# Altium project rtm-lamp.PrjPcb (part 6 of 6)
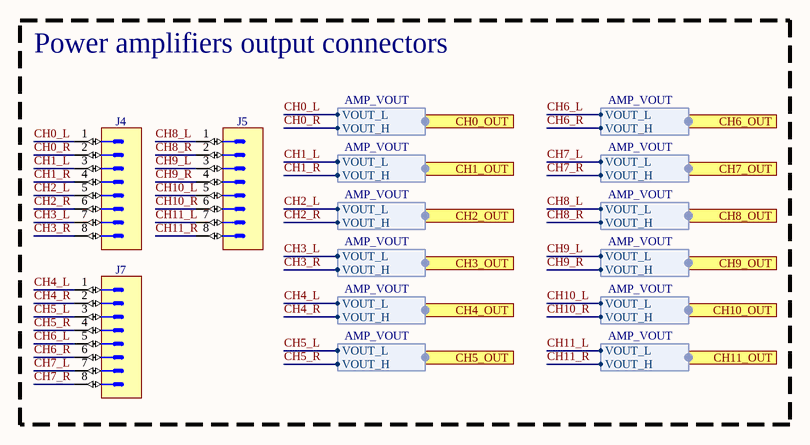
[diagram p9: output-connectors.SchDoc]

## Assembly variants
EXT PWR AFC3.1 SDR: not fitted +2V5 +3V3 +5V +7V +VS1 +VS2 -7V ADC_OCTO_+2V5 ADC_OCTO_+5V ADC_QUAD_+2V5 ADC_QUAD_+5V CNV_ADC1 DAC_VREF+_CH0 DAC_VREF+_CH1 DAC_VREF+_CH2 DAC_VREF+_CH3 DAC_VREF+_CH4 DAC_VREF+_CH5 DAC_VREF+_CH6 DAC_VREF+_CH7 DAC_VREF+_CH8 DAC_VREF+_CH9 DAC_VREF+_CH10 DAC_VREF+_CH11 DACREF1 DACREF2 F2 FTG1 FTG2 FTG3 FTG4 FTG5 FTG6 GND IM_L_CH0 IM_L_CH1 IM_L_CH2 IM_L_CH3 IM_L_CH4 IM_L_CH5 IM_L_CH6 IM_L_CH7 IM_L_CH8 IM_L_CH9 IM_L_CH10 IM_L_CH11 IM_R_CH0 IM_R_CH1 IM_R_CH2 IM_R_CH3 IM_R_CH4 IM_R_CH5 IM_R_CH6 IM_R_CH7 IM_R_CH8 IM_R_CH9 IM_R_CH10 IM_R_CH11 IN+_L_CH0 IN+_L_CH1 IN+_L_CH2 IN+_L_CH3 IN+_L_CH4 IN+_L_CH5 IN+_L_CH6 IN+_L_CH7 IN+_L_CH8 IN+_L_CH9 IN+_L_CH10 IN+_L_CH11 IN+_R_CH0 IN+_R_CH1 IN+_R_CH2 IN+_R_CH3 IN+_R_CH4 IN+_R_CH5 IN+_R_CH6 IN+_R_CH7 IN+_R_CH8 IN+_R_CH9 IN+_R_CH10 IN+_R_CH11 L27 OSC1 R136 R137 R140 REF_ADC_OCTO REF_ADC_QUAD VOUT_L_CH0 VOUT_L_CH1 VOUT_L_CH2 VOUT_L_CH3 VOUT_L_CH4 VOUT_L_CH5 VOUT_L_CH6 VOUT_L_CH7 VOUT_L_CH8 VOUT_L_CH9 VOUT_L_CH10 VOUT_L_CH11 VOUT_R_CH0 VOUT_R_CH1 VOUT_R_CH2 VOUT_R_CH3 VOUT_R_CH4 VOUT_R_CH5 VOUT_R_CH6 VOUT_R_CH7 VOUT_R_CH8 VOUT_R_CH9 VOUT_R_CH10 VOUT_R_CH11
INT PWR AFC3.1 SDR: not fitted +2V5 +3V3 +5V +7V +VS1 +VS2 -7V ADC_OCTO_+2V5 ADC_OCTO_+5V ADC_QUAD_+2V5 ADC_QUAD_+5V CNV_ADC1 DAC_VREF+_CH0 DAC_VREF+_CH1 DAC_VREF+_CH2 DAC_VREF+_CH3 DAC_VREF+_CH4 DAC_VREF+_CH5 DAC_VREF+_CH6 DAC_VREF+_CH7 DAC_VREF+_CH8 DAC_VREF+_CH9 DAC_VREF+_CH10 DAC_VREF+_CH11 DACREF1 DACREF2 F3 FTG1 FTG2 FTG3 FTG4 FTG5 FTG6 GND IM_L_CH0 IM_L_CH1 IM_L_CH2 IM_L_CH3 IM_L_CH4 IM_L_CH5 IM_L_CH6 IM_L_CH7 IM_L_CH8 IM_L_CH9 IM_L_CH10 IM_L_CH11 IM_R_CH0 IM_R_CH1 IM_R_CH2 IM_R_CH3 IM_R_CH4 IM_R_CH5 IM_R_CH6 IM_R_CH7 IM_R_CH8 IM_R_CH9 IM_R_CH10 IM_R_CH11 IN+_L_CH0 IN+_L_CH1 IN+_L_CH2 IN+_L_CH3 IN+_L_CH4 IN+_L_CH5 IN+_L_CH6 IN+_L_CH7 IN+_L_CH8 IN+_L_CH9 IN+_L_CH10 IN+_L_CH11 IN+_R_CH0 IN+_R_CH1 IN+_R_CH2 IN+_R_CH3 IN+_R_CH4 IN+_R_CH5 IN+_R_CH6 IN+_R_CH7 IN+_R_CH8 IN+_R_CH9 IN+_R_CH10 IN+_R_CH11 L27 OSC1 R136 R137 R140 REF_ADC_OCTO REF_ADC_QUAD VOUT_L_CH0 VOUT_L_CH1 VOUT_L_CH2 VOUT_L_CH3 VOUT_L_CH4 VOUT_L_CH5 VOUT_L_CH6 VOUT_L_CH7 VOUT_L_CH8 VOUT_L_CH9 VOUT_L_CH10 VOUT_L_CH11 VOUT_R_CH0 VOUT_R_CH1 VOUT_R_CH2 VOUT_R_CH3 VOUT_R_CH4 VOUT_R_CH5 VOUT_R_CH6 VOUT_R_CH7 VOUT_R_CH8 VOUT_R_CH9 VOUT_R_CH10 VOUT_R_CH11
EXT PWR AFC4 SDR: not fitted +2V5 +3V3 +5V +7V +VS1 +VS2 -7V ADC_OCTO_+2V5 ADC_OCTO_+5V ADC_QUAD_+2V5 ADC_QUAD_+5V CNV_ADC1 DAC_VREF+_CH0 DAC_VREF+_CH1 DAC_VREF+_CH2 DAC_VREF+_CH3 DAC_VREF+_CH4 DAC_VREF+_CH5 DAC_VREF+_CH6 DAC_VREF+_CH7 DAC_VREF+_CH8 DAC_VREF+_CH9 DAC_VREF+_CH10 DAC_VREF+_CH11 DACREF1 DACREF2 F2 FTG1 FTG2 FTG3 FTG4 FTG5 FTG6 GND IM_L_CH0 IM_L_CH1 IM_L_CH2 IM_L_CH3 IM_L_CH4 IM_L_CH5 IM_L_CH6 IM_L_CH7 IM_L_CH8 IM_L_CH9 IM_L_CH10 IM_L_CH11 IM_R_CH0 IM_R_CH1 IM_R_CH2 IM_R_CH3 IM_R_CH4 IM_R_CH5 IM_R_CH6 IM_R_CH7 IM_R_CH8 IM_R_CH9 IM_R_CH10 IM_R_CH11 IN+_L_CH0 IN+_L_CH1 IN+_L_CH2 IN+_L_CH3 IN+_L_CH4 IN+_L_CH5 IN+_L_CH6 IN+_L_CH7 IN+_L_CH8 IN+_L_CH9 IN+_L_CH10 IN+_L_CH11 IN+_R_CH0 IN+_R_CH1 IN+_R_CH2 IN+_R_CH3 IN+_R_CH4 IN+_R_CH5 IN+_R_CH6 IN+_R_CH7 IN+_R_CH8 IN+_R_CH9 IN+_R_CH10 IN+_R_CH11 L28 OSC1 R14 R136 R137 REF_ADC_OCTO REF_ADC_QUAD VOUT_L_CH0 VOUT_L_CH1 VOUT_L_CH2 VOUT_L_CH3 VOUT_L_CH4 VOUT_L_CH5 VOUT_L_CH6 VOUT_L_CH7 VOUT_L_CH8 VOUT_L_CH9 VOUT_L_CH10 VOUT_L_CH11 VOUT_R_CH0 VOUT_R_CH1 VOUT_R_CH2 VOUT_R_CH3 VOUT_R_CH4 VOUT_R_CH5 VOUT_R_CH6 VOUT_R_CH7 VOUT_R_CH8 VOUT_R_CH9 VOUT_R_CH10 VOUT_R_CH11
INT PWR AFC4 SDR: not fitted +2V5 +3V3 +5V +7V +VS1 +VS2 -7V ADC_OCTO_+2V5 ADC_OCTO_+5V ADC_QUAD_+2V5 ADC_QUAD_+5V CNV_ADC1 DAC_VREF+_CH0 DAC_VREF+_CH1 DAC_VREF+_CH2 DAC_VREF+_CH3 DAC_VREF+_CH4 DAC_VREF+_CH5 DAC_VREF+_CH6 DAC_VREF+_CH7 DAC_VREF+_CH8 DAC_VREF+_CH9 DAC_VREF+_CH10 DAC_VREF+_CH11 DACREF1 DACREF2 F3 FTG1 FTG2 FTG3 FTG4 FTG5 FTG6 GND IM_L_CH0 IM_L_CH1 IM_L_CH2 IM_L_CH3 IM_L_CH4 IM_L_CH5 IM_L_CH6 IM_L_CH7 IM_L_CH8 IM_L_CH9 IM_L_CH10 IM_L_CH11 IM_R_CH0 IM_R_CH1 IM_R_CH2 IM_R_CH3 IM_R_CH4 IM_R_CH5 IM_R_CH6 IM_R_CH7 IM_R_CH8 IM_R_CH9 IM_R_CH10 IM_R_CH11 IN+_L_CH0 IN+_L_CH1 IN+_L_CH2 IN+_L_CH3 IN+_L_CH4 IN+_L_CH5 IN+_L_CH6 IN+_L_CH7 IN+_L_CH8 IN+_L_CH9 IN+_L_CH10 IN+_L_CH11 IN+_R_CH0 IN+_R_CH1 IN+_R_CH2 IN+_R_CH3 IN+_R_CH4 IN+_R_CH5 IN+_R_CH6 IN+_R_CH7 IN+_R_CH8 IN+_R_CH9 IN+_R_CH10 IN+_R_CH11 L28 OSC1 R14 R136 R137 REF_ADC_OCTO REF_ADC_QUAD VOUT_L_CH0 VOUT_L_CH1 VOUT_L_CH2 VOUT_L_CH3 VOUT_L_CH4 VOUT_L_CH5 VOUT_L_CH6 VOUT_L_CH7 VOUT_L_CH8 VOUT_L_CH9 VOUT_L_CH10 VOUT_L_CH11 VOUT_R_CH0 VOUT_R_CH1 VOUT_R_CH2 VOUT_R_CH3 VOUT_R_CH4 VOUT_R_CH5 VOUT_R_CH6 VOUT_R_CH7 VOUT_R_CH8 VOUT_R_CH9 VOUT_R_CH10 VOUT_R_CH11
EXT PWR AFC3.1 DDR: not fitted +2V5 +3V3 +5V +7V +VS1 +VS2 -7V ADC_OCTO_+2V5 ADC_OCTO_+5V ADC_QUAD_+2V5 ADC_QUAD_+5V CNV_ADC1 DAC_VREF+_CH0 DAC_VREF+_CH1 DAC_VREF+_CH2 DAC_VREF+_CH3 DAC_VREF+_CH4 DAC_VREF+_CH5 DAC_VREF+_CH6 DAC_VREF+_CH7 DAC_VREF+_CH8 DAC_VREF+_CH9 DAC_VREF+_CH10 DAC_VREF+_CH11 DACREF1 DACREF2 F2 FTG1 FTG2 FTG3 FTG4 FTG5 FTG6 GND IM_L_CH0 IM_L_CH1 IM_L_CH2 IM_L_CH3 IM_L_CH4 IM_L_CH5 IM_L_CH6 IM_L_CH7 IM_L_CH8 IM_L_CH9 IM_L_CH10 IM_L_CH11 IM_R_CH0 IM_R_CH1 IM_R_CH2 IM_R_CH3 IM_R_CH4 IM_R_CH5 IM_R_CH6 IM_R_CH7 IM_R_CH8 IM_R_CH9 IM_R_CH10 IM_R_CH11 IN+_L_CH0 IN+_L_CH1 IN+_L_CH2 IN+_L_CH3 IN+_L_CH4 IN+_L_CH5 IN+_L_CH6 IN+_L_CH7 IN+_L_CH8 IN+_L_CH9 IN+_L_CH10 IN+_L_CH11 IN+_R_CH0 IN+_R_CH1 IN+_R_CH2 IN+_R_CH3 IN+_R_CH4 IN+_R_CH5 IN+_R_CH6 IN+_R_CH7 IN+_R_CH8 IN+_R_CH9 IN+_R_CH10 IN+_R_CH11 L27 OSC1 R19 R135 R140 REF_ADC_OCTO REF_ADC_QUAD VOUT_L_CH0 VOUT_L_CH1 VOUT_L_CH2 VOUT_L_CH3 VOUT_L_CH4 VOUT_L_CH5 VOUT_L_CH6 VOUT_L_CH7 VOUT_L_CH8 VOUT_L_CH9 VOUT_L_CH10 VOUT_L_CH11 VOUT_R_CH0 VOUT_R_CH1 VOUT_R_CH2 VOUT_R_CH3 VOUT_R_CH4 VOUT_R_CH5 VOUT_R_CH6 VOUT_R_CH7 VOUT_R_CH8 VOUT_R_CH9 VOUT_R_CH10 VOUT_R_CH11
INT PWR AFC3.1 DDR: not fitted +2V5 +3V3 +5V +7V +VS1 +VS2 -7V ADC_OCTO_+2V5 ADC_OCTO_+5V ADC_QUAD_+2V5 ADC_QUAD_+5V CNV_ADC1 DAC_VREF+_CH0 DAC_VREF+_CH1 DAC_VREF+_CH2 DAC_VREF+_CH3 DAC_VREF+_CH4 DAC_VREF+_CH5 DAC_VREF+_CH6 DAC_VREF+_CH7 DAC_VREF+_CH8 DAC_VREF+_CH9 DAC_VREF+_CH10 DAC_VREF+_CH11 DACREF1 DACREF2 F3 FTG1 FTG2 FTG3 FTG4 FTG5 FTG6 GND IM_L_CH0 IM_L_CH1 IM_L_CH2 IM_L_CH3 IM_L_CH4 IM_L_CH5 IM_L_CH6 IM_L_CH7 IM_L_CH8 IM_L_CH9 IM_L_CH10 IM_L_CH11 IM_R_CH0 IM_R_CH1 IM_R_CH2 IM_R_CH3 IM_R_CH4 IM_R_CH5 IM_R_CH6 IM_R_CH7 IM_R_CH8 IM_R_CH9 IM_R_CH10 IM_R_CH11 IN+_L_CH0 IN+_L_CH1 IN+_L_CH2 IN+_L_CH3 IN+_L_CH4 IN+_L_CH5 IN+_L_CH6 IN+_L_CH7 IN+_L_CH8 IN+_L_CH9 IN+_L_CH10 IN+_L_CH11 IN+_R_CH0 IN+_R_CH1 IN+_R_CH2 IN+_R_CH3 IN+_R_CH4 IN+_R_CH5 IN+_R_CH6 IN+_R_CH7 IN+_R_CH8 IN+_R_CH9 IN+_R_CH10 IN+_R_CH11 L27 OSC1 R19 R135 R140 REF_ADC_OCTO REF_ADC_QUAD VOUT_L_CH0 VOUT_L_CH1 VOUT_L_CH2 VOUT_L_CH3 VOUT_L_CH4 VOUT_L_CH5 VOUT_L_CH6 VOUT_L_CH7 VOUT_L_CH8 VOUT_L_CH9 VOUT_L_CH10 VOUT_L_CH11 VOUT_R_CH0 VOUT_R_CH1 VOUT_R_CH2 VOUT_R_CH3 VOUT_R_CH4 VOUT_R_CH5 VOUT_R_CH6 VOUT_R_CH7 VOUT_R_CH8 VOUT_R_CH9 VOUT_R_CH10 VOUT_R_CH11
EXT PWR AFC4 DDR: not fitted +2V5 +3V3 +5V +7V +VS1 +VS2 -7V ADC_OCTO_+2V5 ADC_OCTO_+5V ADC_QUAD_+2V5 ADC_QUAD_+5V CNV_ADC1 DAC_VREF+_CH0 DAC_VREF+_CH1 DAC_VREF+_CH2 DAC_VREF+_CH3 DAC_VREF+_CH4 DAC_VREF+_CH5 DAC_VREF+_CH6 DAC_VREF+_CH7 DAC_VREF+_CH8 DAC_VREF+_CH9 DAC_VREF+_CH10 DAC_VREF+_CH11 DACREF1 DACREF2 F2 FTG1 FTG2 FTG3 FTG4 FTG5 FTG6 GND IM_L_CH0 IM_L_CH1 IM_L_CH2 IM_L_CH3 IM_L_CH4 IM_L_CH5 IM_L_CH6 IM_L_CH7 IM_L_CH8 IM_L_CH9 IM_L_CH10 IM_L_CH11 IM_R_CH0 IM_R_CH1 IM_R_CH2 IM_R_CH3 IM_R_CH4 IM_R_CH5 IM_R_CH6 IM_R_CH7 IM_R_CH8 IM_R_CH9 IM_R_CH10 IM_R_CH11 IN+_L_CH0 IN+_L_CH1 IN+_L_CH2 IN+_L_CH3 IN+_L_CH4 IN+_L_CH5 IN+_L_CH6 IN+_L_CH7 IN+_L_CH8 IN+_L_CH9 IN+_L_CH10 IN+_L_CH11 IN+_R_CH0 IN+_R_CH1 IN+_R_CH2 IN+_R_CH3 IN+_R_CH4 IN+_R_CH5 IN+_R_CH6 IN+_R_CH7 IN+_R_CH8 IN+_R_CH9 IN+_R_CH10 IN+_R_CH11 L28 OSC1 R14 R19 R135 REF_ADC_OCTO REF_ADC_QUAD VOUT_L_CH0 VOUT_L_CH1 VOUT_L_CH2 VOUT_L_CH3 VOUT_L_CH4 VOUT_L_CH5 VOUT_L_CH6 VOUT_L_CH7 VOUT_L_CH8 VOUT_L_CH9 VOUT_L_CH10 VOUT_L_CH11 VOUT_R_CH0 VOUT_R_CH1 VOUT_R_CH2 VOUT_R_CH3 VOUT_R_CH4 VOUT_R_CH5 VOUT_R_CH6 VOUT_R_CH7 VOUT_R_CH8 VOUT_R_CH9 VOUT_R_CH10 VOUT_R_CH11
INT PWR AFC4 DDR: not fitted +2V5 +3V3 +5V +7V +VS1 +VS2 -7V ADC_OCTO_+2V5 ADC_OCTO_+5V ADC_QUAD_+2V5 ADC_QUAD_+5V CNV_ADC1 DAC_VREF+_CH0 DAC_VREF+_CH1 DAC_VREF+_CH2 DAC_VREF+_CH3 DAC_VREF+_CH4 DAC_VREF+_CH5 DAC_VREF+_CH6 DAC_VREF+_CH7 DAC_VREF+_CH8 DAC_VREF+_CH9 DAC_VREF+_CH10 DAC_VREF+_CH11 DACREF1 DACREF2 F3 FTG1 FTG2 FTG3 FTG4 FTG5 FTG6 GND IM_L_CH0 IM_L_CH1 IM_L_CH2 IM_L_CH3 IM_L_CH4 IM_L_CH5 IM_L_CH6 IM_L_CH7 IM_L_CH8 IM_L_CH9 IM_L_CH10 IM_L_CH11 IM_R_CH0 IM_R_CH1 IM_R_CH2 IM_R_CH3 IM_R_CH4 IM_R_CH5 IM_R_CH6 IM_R_CH7 IM_R_CH8 IM_R_CH9 IM_R_CH10 IM_R_CH11 IN+_L_CH0 IN+_L_CH1 IN+_L_CH2 IN+_L_CH3 IN+_L_CH4 IN+_L_CH5 IN+_L_CH6 IN+_L_CH7 IN+_L_CH8 IN+_L_CH9 IN+_L_CH10 IN+_L_CH11 IN+_R_CH0 IN+_R_CH1 IN+_R_CH2 IN+_R_CH3 IN+_R_CH4 IN+_R_CH5 IN+_R_CH6 IN+_R_CH7 IN+_R_CH8 IN+_R_CH9 IN+_R_CH10 IN+_R_CH11 L28 OSC1 R14 R19 R135 REF_ADC_OCTO REF_ADC_QUAD VOUT_L_CH0 VOUT_L_CH1 VOUT_L_CH2 VOUT_L_CH3 VOUT_L_CH4 VOUT_L_CH5 VOUT_L_CH6 VOUT_L_CH7 VOUT_L_CH8 VOUT_L_CH9 VOUT_L_CH10 VOUT_L_CH11 VOUT_R_CH0 VOUT_R_CH1 VOUT_R_CH2 VOUT_R_CH3 VOUT_R_CH4 VOUT_R_CH5 VOUT_R_CH6 VOUT_R_CH7 VOUT_R_CH8 VOUT_R_CH9 VOUT_R_CH10 VOUT_R_CH11
INT PWR AFC3.1 SDR 8CH: not fitted +2V5 +3V3 +5V +7V +VS1 +VS2 -7V ADC_OCTO_+2V5 ADC_OCTO_+5V ADC_QUAD_+2V5 ADC_QUAD_+5V C83_CH8 C83_CH9 C83_CH10 C83_CH11 CNV_ADC1 D2_CH8 D2_CH9 D2_CH10 D2_CH11 D3_CH8 D3_CH9 D3_CH10 D3_CH11 D4_CH8 D4_CH9 D4_CH10 D4_CH11 D5_CH8 D5_CH9 D5_CH10 D5_CH11 DAC_VREF+_CH0 DAC_VREF+_CH1 DAC_VREF+_CH2 DAC_VREF+_CH3 DAC_VREF+_CH4 DAC_VREF+_CH5 DAC_VREF+_CH6 DAC_VREF+_CH7 DAC_VREF+_CH8 DAC_VREF+_CH9 DAC_VREF+_CH10 DAC_VREF+_CH11 DACREF1 DACREF2 F3 FTG1 FTG2 FTG3 FTG4 FTG5 FTG6 GND IC26_CH8 IC26_CH9 IC26_CH10 IC26_CH11 IC27_CH8 IC27_CH9 IC27_CH10 IC27_CH11 IC28_CH8 IC28_CH9 IC28_CH10 IC28_CH11 IC29_CH8 IC29_CH9 IC29_CH10 IC29_CH11 IC39 IM_L_CH0 IM_L_CH1 IM_L_CH2 IM_L_CH3 IM_L_CH4 IM_L_CH5 IM_L_CH6 IM_L_CH7 IM_L_CH8 IM_L_CH9 IM_L_CH10 IM_L_CH11 IM_R_CH0 IM_R_CH1 IM_R_CH2 IM_R_CH3 IM_R_CH4 IM_R_CH5 IM_R_CH6 IM_R_CH7 IM_R_CH8 IM_R_CH9 IM_R_CH10 IM_R_CH11 IN+_L_CH0 IN+_L_CH1 IN+_L_CH2 IN+_L_CH3 IN+_L_CH4 IN+_L_CH5 IN+_L_CH6 IN+_L_CH7 IN+_L_CH8 IN+_L_CH9 IN+_L_CH10 IN+_L_CH11 IN+_R_CH0 IN+_R_CH1 IN+_R_CH2 IN+_R_CH3 IN+_R_CH4 IN+_R_CH5 IN+_R_CH6 IN+_R_CH7 IN+_R_CH8 IN+_R_CH9 IN+_R_CH10 IN+_R_CH11 L27 OSC1 R83_CH8 R83_CH9 R83_CH10 R83_CH11 R136 R137 R140 REF_ADC_OCTO REF_ADC_QUAD RN1_CH8 RN1_CH9 RN1_CH10 RN1_CH11 VOUT_L_CH0 VOUT_L_CH1 VOUT_L_CH2 VOUT_L_CH3 VOUT_L_CH4 VOUT_L_CH5 VOUT_L_CH6 VOUT_L_CH7 VOUT_L_CH8 VOUT_L_CH9 VOUT_L_CH10 VOUT_L_CH11 VOUT_R_CH0 VOUT_R_CH1 VOUT_R_CH2 VOUT_R_CH3 VOUT_R_CH4 VOUT_R_CH5 VOUT_R_CH6 VOUT_R_CH7 VOUT_R_CH8 VOUT_R_CH9 VOUT_R_CH10 VOUT_R_CH11